# Altium schematic sheet Microcontroller and Memory.SCHDOC
size A4
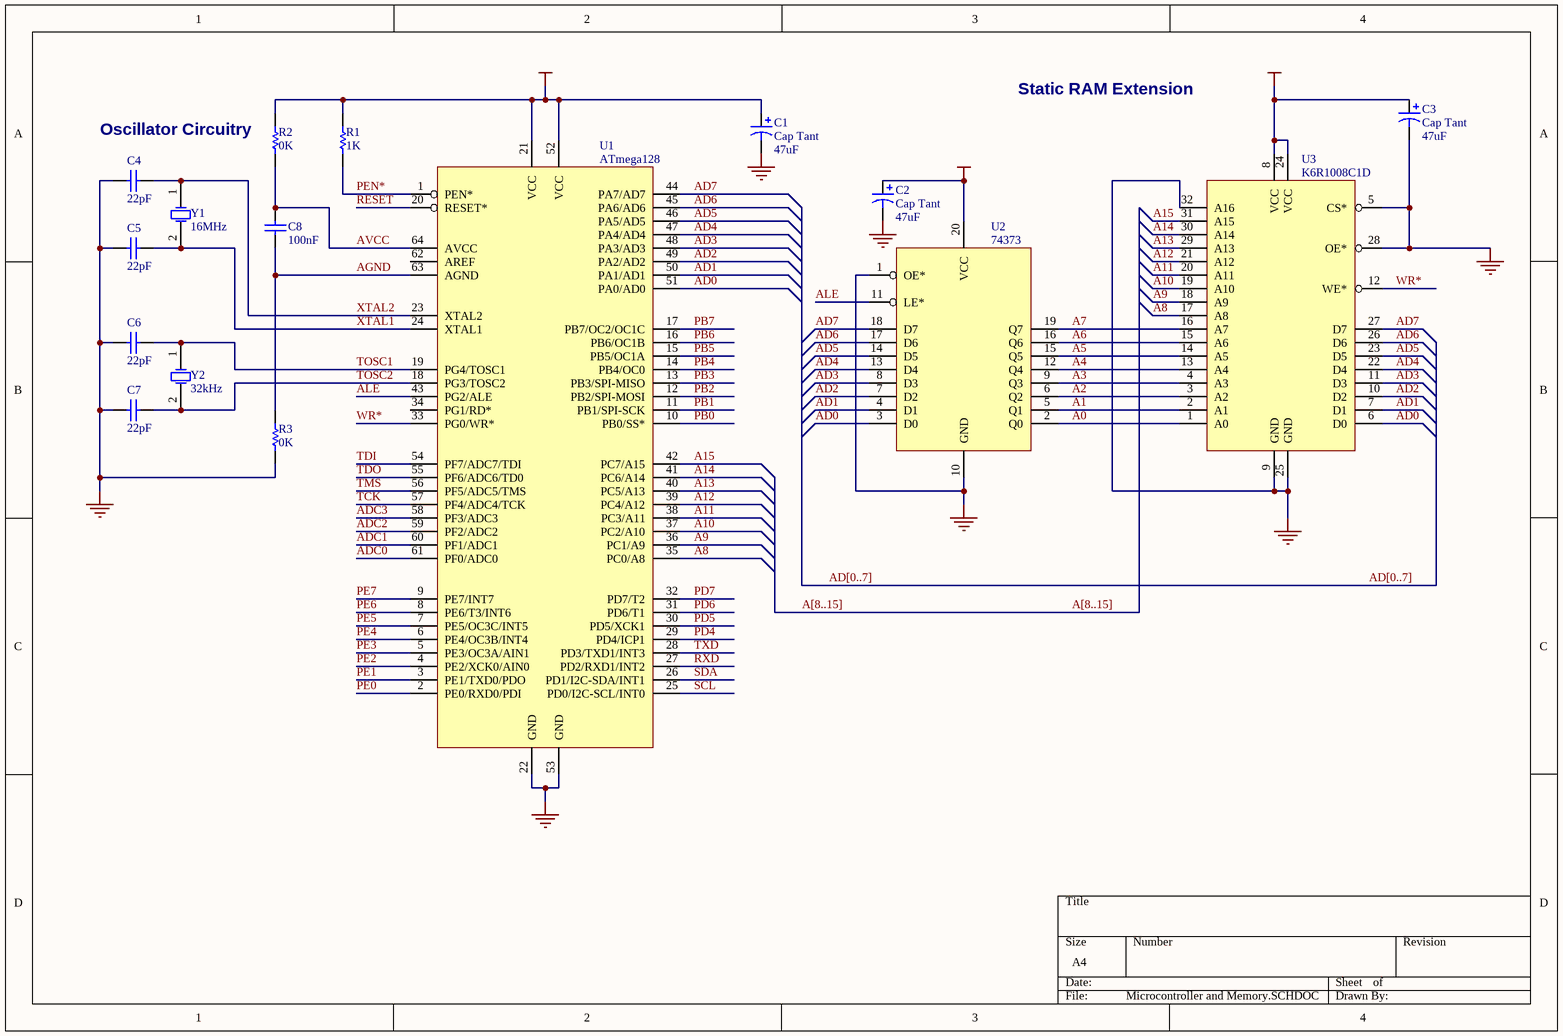
[diagram p0: Microcontroller and Memory.SCHDOC]

## Parts
C1  Cap Tant  value 47uF  [CAPR5-4X5]
C2  Cap Tant  value 47uF  [CAPR5-4X5]
C3  Cap Tant  value 47uF  [CAPR5-4X5]
C4  22pF  [BCY-W2/D3.1]
C5  22pF  [BCY-W2/D3.1]
C6  22pF  [BCY-W2/D3.1]
C7  22pF  [BCY-W2/D3.1]
C8  100nF  [BCY-W2/D3.1]
R1  1K  [AXIAL-0.3]
R2  0K  [AXIAL-0.3]
R3  0K  [AXIAL-0.3]
U1  ATmega128  [QFP14x14-G64/Y1.4N]
U2  74373  [SO-G20/Y1.45]
U3  K6R1008C1D  [SO-G32/Y1.45]
Y1  16MHz  [BCY-W2/D3.1]
Y2  32kHz  [BCY-W2/D3.1]

## Nets
5V: C1.1 C2.1 C3.1 R1.2 R2.2 U1.21(VCC) U1.52(VCC) U2.20(VCC) U3.8(VCC) U3.24(VCC)
GND: C1.2 C2.2 C3.2 C4.1 C5.1 C6.1 C7.1 R3.1 U1.22(GND) U1.53(GND) U2.1(OE*) U2.10(GND) U3.5(CS*) U3.9(GND) U3.25(GND) U3.28(OE*) U3.32(A16)
A0: U2.2(Q0) U3.1(A0)
A1: U2.5(Q1) U3.2(A1)
A2: U2.6(Q2) U3.3(A2)
A3: U2.9(Q3) U3.4(A3)
A4: U2.12(Q4) U3.13(A4)
A5: U2.15(Q5) U3.14(A5)
A6: U2.16(Q6) U3.15(A6)
A7: U2.19(Q7) U3.16(A7)
A8: U1.35(PC0/A8) U3.17(A8)
A9: U1.36(PC1/A9) U3.18(A9)
A10: U1.37(PC2/A10) U3.19(A10)
A11: U1.38(PC3/A11) U3.20(A11)
A12: U1.39(PC4/A12) U3.21(A12)
A13: U1.40(PC5/A13) U3.29(A13)
A14: U1.41(PC6/A14) U3.30(A14)
A15: U1.42(PC7/A15) U3.31(A15)
AD0: U1.51(PA0/AD0) U2.3(D0) U3.6(D0)
AD1: U1.50(PA1/AD1) U2.4(D1) U3.7(D1)
AD2: U1.49(PA2/AD2) U2.7(D2) U3.10(D2)
AD3: U1.48(PA3/AD3) U2.8(D3) U3.11(D3)
AD4: U1.47(PA4/AD4) U2.13(D4) U3.22(D4)
AD5: U1.46(PA5/AD5) U2.14(D5) U3.23(D5)
AD6: U1.45(PA6/AD6) U2.17(D6) U3.26(D6)
AD7: U1.44(PA7/AD7) U2.18(D7) U3.27(D7)
ADC0: U1.61(PF0/ADC0)
ADC1: U1.60(PF1/ADC1)
ADC2: U1.59(PF2/ADC2)
ADC3: U1.58(PF3/ADC3)
AGND: C8.1 R3.2 U1.63(AGND)
ALE: U1.43(PG2/ALE) U2.11(LE*)
AVCC: C8.2 R2.1 U1.64(AVCC)
PB0: U1.10(PB0/SS*)
PB1: U1.11(PB1/SPI-SCK)
PB2: U1.12(PB2/SPI-MOSI)
PB3: U1.13(PB3/SPI-MISO)
PB4: U1.14(PB4/OC0)
PB5: U1.15(PB5/OC1A)
PB6: U1.16(PB6/OC1B)
PB7: U1.17(PB7/OC2/OC1C)
PD4: U1.29(PD4/ICP1)
PD5: U1.30(PD5/XCK1)
PD6: U1.31(PD6/T1)
PD7: U1.32(PD7/T2)
PE0: U1.2(PE0/RXD0/PDI)
PE1: U1.3(PE1/TXD0/PDO)
PE2: U1.4(PE2/XCK0/AIN0)
PE3: U1.5(PE3/OC3A/AIN1)
PE4: U1.6(PE4/OC3B/INT4)
PE5: U1.7(PE5/OC3C/INT5)
PE6: U1.8(PE6/T3/INT6)
PE7: U1.9(PE7/INT7)
PEN*: R1.1 U1.1(PEN*)
RESET: U1.20(RESET*)
RXD: U1.27(PD2/RXD1/INT2)
SCL: U1.25(PD0/I2C-SCL/INT0)
SDA: U1.26(PD1/I2C-SDA/INT1)
TCK: U1.57(PF4/ADC4/TCK)
TDI: U1.54(PF7/ADC7/TDI)
TDO: U1.55(PF6/ADC6/TD0)
TMS: U1.56(PF5/ADC5/TMS)
TOSC1: C6.2 U1.19(PG4/TOSC1) Y2.1(OSC1)
TOSC2: C7.2 U1.18(PG3/TOSC2) Y2.2(OSC2)
TXD: U1.28(PD3/TXD1/INT3)
WR*: U1.33(PG0/WR*) U3.12(WE*)
XTAL1: C5.2 U1.24(XTAL1) Y1.2(OSC2)
XTAL2: C4.2 U1.23(XTAL2) Y1.1(OSC1)

Not connected (* = marked no-connect by the designer): U1 34(PG1/RD*) 62(AREF)

## Buses and harness runs
bus A[8..15]
bus AD[0..7]

## Notes on the sheet
- Static RAM Extension
- (near R2) Oscillator Circuitry

## Library data of the parts
C1-C3 = Cap Pol2: Polarized Capacitor (Axial); Published: 8-Jun-2000; Revision: July-2002: Re-released for DXP Platform.; Publisher: Altium Limited
C4-C8 = Cap: Capacitor; Published: 8-Jun-2000; Revision: July-2002: Re-released for DXP Platform.; Publisher: Altium Limited
R1-R3 = Res1: Resistor; Published: 8-Jun-2000; Revision: July-2002: Re-released for DXP Platform.; Publisher: Altium Limited
U1 = ATmega128: Atmel ATmega128 MCU
U2 = 74373: Octal 8-bit D-type Latch
U3 = K6R1008C1D: Samsung 128Kx8 High-Speed Static RAM
Y1 Y2 = XTAL: Crystal Oscillator; Published: 8-Jun-2000; Revision: July-2002: Re-released for DXP Platform.; Publisher: Altium Limited